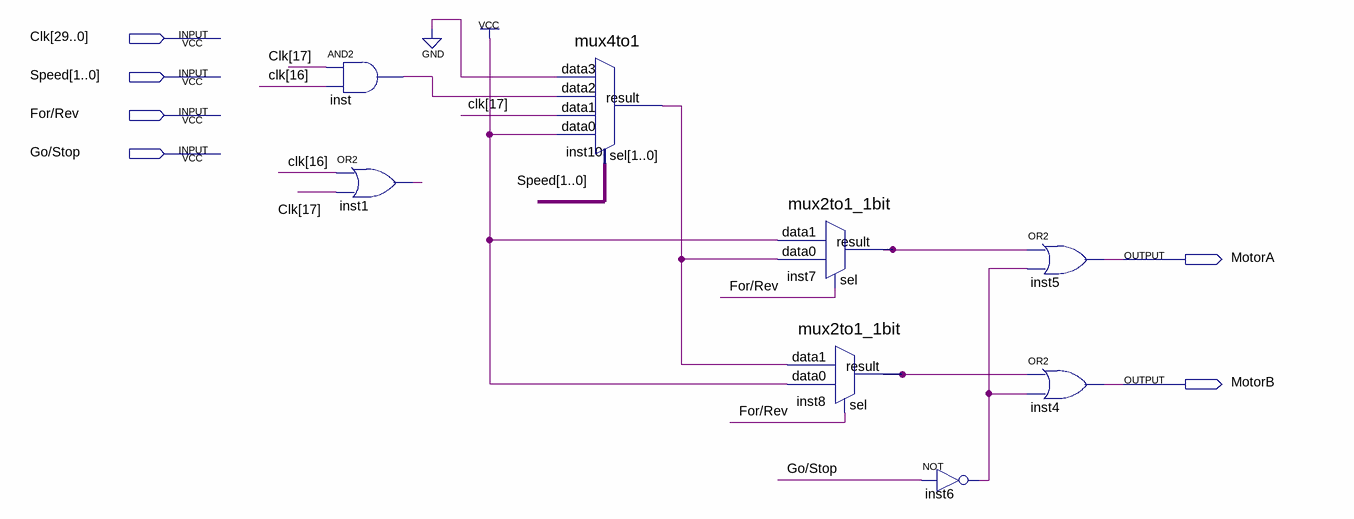
[diagram p0: schematic sheet]
// Quartus schematic MotorController.bdf as structural Verilog: 8 symbols, 6 pins
module MotorController (
  input  [29:0] Clk,
  input  [1:0] Speed,
  input  \For/Rev ,
  input  \Go/Stop ,
  output MotorA,
  output MotorB
);

  wire inst1_out, inst6_out, inst7_result, inst8_result, inst10_result, inst_out;

  and inst (inst_out, Clk[17], Clk[16]);
  or inst1 (inst1_out, Clk[16], Clk[17]);
  mux4to1 inst10 (.data3(1'b0), .data2(inst_out), .data1(Clk[17]), .data0(1'b1), .sel(Speed), .result(inst10_result));
  mux2to1_1bit inst7 (.data1(1'b1), .data0(inst10_result), .sel(\For/Rev ), .result(inst7_result));
  mux2to1_1bit inst8 (.data1(inst10_result), .data0(1'b1), .sel(\For/Rev ), .result(inst8_result));
  not inst6 (inst6_out, \Go/Stop );
  or inst5 (MotorA, inst7_result, inst6_out);
  or inst4 (MotorB, inst8_result, inst6_out);
endmodule
